# EAGLE design HW2 (EAGLE 9.3.0)
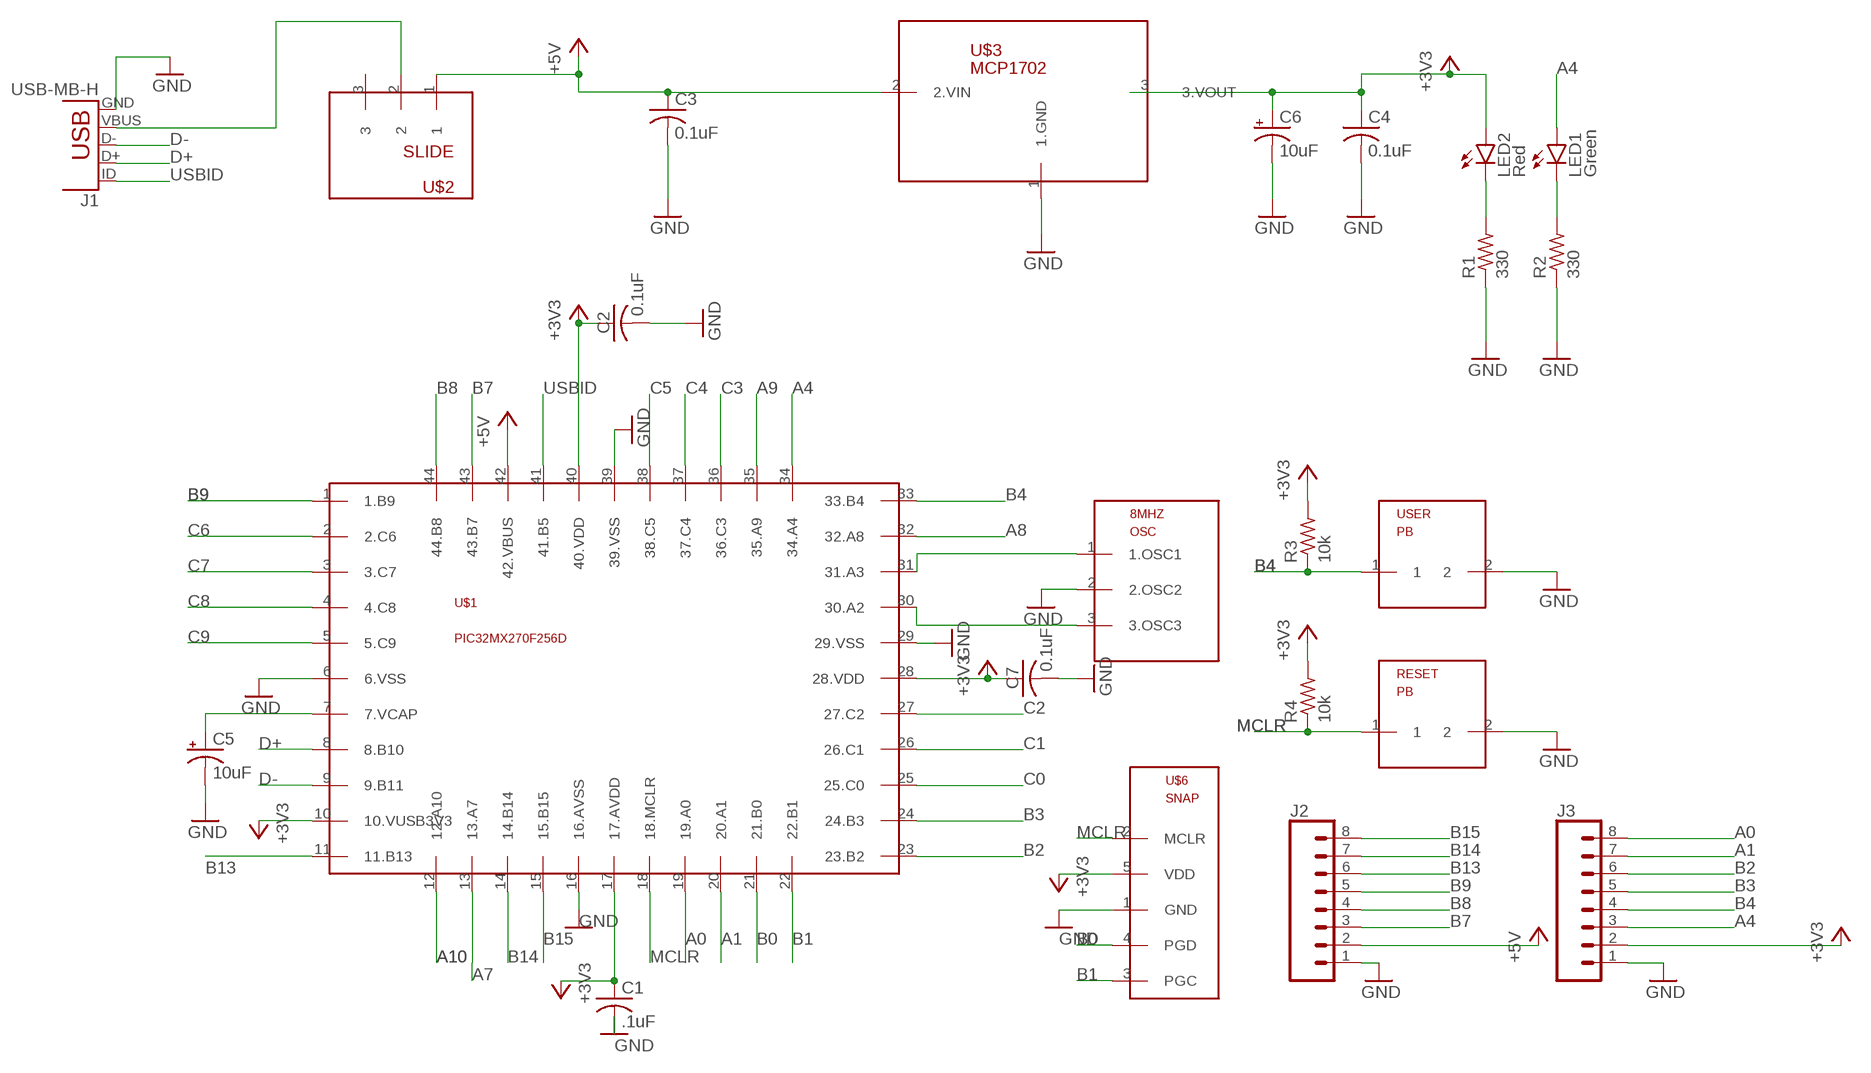
[diagram p0: schematic, sheet 1]

## Parts
8MHZ  OSC  [OSC]
C1  .1uF  C-US025-025X050  [C025-025X050]
C2  0.1uF  C-US025-025X050  [C025-025X050]
C3  0.1uF  C-US025-025X050  [C025-025X050]
C4  0.1uF  C-US025-025X050  [C025-025X050]
C5  10uF  CPOL-USB45181B  [B45181B]
C6  10uF  CPOL-USB45181B  [B45181B]
C7  0.1uF  C-US025-025X050  [C025-025X050]
J1  USB-MB-H  [USB-MB-H]
J2  CONN_08  [CONN_08]
J3  CONN_08  [CONN_08]
LED1  Green  LED3MM  [LED3MM]
LED2  Red  LED3MM  [LED3MM]
R1  330  R-US_0207/10  [0207/10]
R2  330  R-US_0207/10  [0207/10]
R3  10k  R-US_0207/10  [0207/10]
R4  10k  R-US_0207/10  [0207/10]
RESET  PB  [PB]
U$1  PIC32MX270F256D  [MQFP44-2]
U$2  SLIDE  [SLIDE]
U$3  MCP1702  [TO92]
U$6  SNAP  [1X05]
USER  PB  [PB]

## Nets
+3V3: C1.1 C2.1 C4.1 C6.+ C7.1 J3.2 LED2.A R3.2 R4.2 U$1.10(10.VUSB3V3) U$1.17(17.AVDD) U$1.28(28.VDD) U$1.40(40.VDD) U$3.3(3.VOUT) U$6.5(VDD)
+5V: C3.1 J2.2 U$1.42(42.VBUS) U$2.1 U$3.2(2.VIN)
A0: J3.8 U$1.19(19.A0)
A1: J3.7 U$1.20(20.A1)
A4: J3.3 LED1.A U$1.34(34.A4)
A7: U$1.13(13.A7)
A8: U$1.32(32.A8)
A9: U$1.35(35.A9)
A10: U$1.12(12.A10)
B0: U$1.21(21.B0) U$6.4(PGD)
B1: U$1.22(22.B1) U$6.3(PGC)
B2: J3.6 U$1.23(23.B2)
B3: J3.5 U$1.24(24.B3)
B4: J3.4 R3.1 U$1.33(33.B4) USER.1
B7: J2.3 U$1.43(43.B7)
B8: J2.4 U$1.44(44.B8)
B9: J2.5 U$1.1(1.B9)
B13: J2.6 U$1.11(11.B13)
B14: J2.7 U$1.14(14.B14)
B15: J2.8 U$1.15(15.B15)
C0: U$1.25(25.C0)
C1: U$1.26(26.C1)
C2: U$1.27(27.C2)
C3: U$1.36(36.C3)
C4: U$1.37(37.C4)
C5: U$1.38(38.C5)
C6: U$1.2(2.C6)
C7: U$1.3(3.C7)
C8: U$1.4(4.C8)
C9: U$1.5(5.C9)
D+: J1.D+ U$1.8(8.B10)
D-: J1.D- U$1.9(9.B11)
GND: 8MHZ.2(2.OSC2) C1.2 C2.2 C3.2 C4.2 C5.- C6.- C7.2 J1.GND J2.1 J3.1 R1.1 R2.1 RESET.2 U$1.6(6.VSS) U$1.16(16.AVSS) U$1.29(29.VSS) U$1.39(39.VSS) U$3.1(1.GND) U$6.1(GND) USER.2
MCLR: R4.1 RESET.1 U$1.18(18.MCLR) U$6.2(MCLR)
N$1: J1.VBUS U$2.2
N$2: LED2.K(C) R1.2
N$3: 8MHZ.1(1.OSC1) U$1.31(31.A3)
N$4: 8MHZ.3(3.OSC3) U$1.30(30.A2)
N$5: C5.+ U$1.7(7.VCAP)
N$6: LED1.K(C) R2.2
USBID: J1.ID U$1.41(41.B5)
Unconnected: U$2.3

## Library data of the parts
8MHZ = me_433_1:OSC
C1-C4 C7 = me_433_1:C-US: CAPACITOR, American symbol; SPICEPREFIX: C
C5 C6 = me_433_1:CPOL-US: POLARIZED CAPACITOR, American symbol; SPICEPREFIX: C
J1 = me_433_1:USB: USB Connectors USB-B-PTH is fully proven SKU : PRT-00139/CONN-08278 USB-miniB is fully proven SKU : PRT-00587 USB-A-PCB is untested. USB-A-H is throughly reviewed, but untested. Spark Fun Electronics SKU : PRT-00437 USB-B-SMT is throughly reviewed, but untested. Needs silkscreen touching up. USB-A-S has not been used/tested USB-MB-H has not been used/tested USB-MICROB has been used. CONN-09505
J2 J3 = me_433_1:CONN_08: Multi connection point. Often used as Generic Header-pin footprint for 0.1 inch spaced/style header connections On any of the 0.1 inch spaced packages, you can populate with these: Break Away Headers - Straight <https://www.sparkfun.com/products/116> (PRT-00116) Break Away Male Headers - Right Angle <https://www.sparkfun.com/products/553> (PRT-00553) Female Headers <https://www.sparkfun.com/products/115> (PRT-00115) Break Away Headers - Machine Pin <https://www.sparkfun.com/products/117> (PRT-00117) Break Away Female Headers - Swiss Machine Pin <https://www.sparkfun.com/products/743> (PRT-00743) Arduino Stackable Header - 8 Pin <https://www.sparkfun.com/products/9279> (PRT-09279) For SCREWTERMINALS and SPRING TERMINALS visit here: Screw Terimnals on SparkFun.com <https://www.sparkfun.com/search/results?term=Screw+Terminals> (5mm/3.5mm/2.54mm spacing) This device is also useful as a general connection point to wire up your design to another part of your project. Our various solder wires solder well into these plated through hole pads. Hook-Up Wire - Assortment (Stranded, 22 AWG) <https://www.sparkfun.com/products/11375> (PRT-11375) Hook-Up Wire - Assortment (Solid Core, 22 AWG) <https://www.sparkfun.com/products/11367> (PRT-11367) View the entire wire category on our website here <https://www.sparkfun.com/categories/141> Special notes: Molex polarized connector foot print use with SKU : PRT-08231 with associated crimp pins and housings. 1MM SMD Version SKU: PRT-10208 NOTES ON THE VARIANTS LOCK and LOCK_LONGPADS... This footprint was designed to help hold the alignment of a through-hole component (i.e. 6-pin header) while soldering it into place. You may notice that each hole has been shifted either up or down by 0.005 of an inch from it's more standard position (which is a perfectly straight line). This slight alteration caused the pins (the squares in the middle) to touch the edges of the holes. Because they are alternating, it causes a "brace" to hold the component in place. 0.005 has proven to be the perfect amount of "off-center" position when using our standard breakaway headers. Although looks a little odd when you look at the bare footprint, once you have a header in there, the alteration is very hard to notice. Also,if you push a header all the way into place, it is covered up entirely on the bottom side.
LED1 LED2 = led:LED: LED OSRAM: - CHIPLED LG R971, LG N971, LY N971, LG Q971, LY Q971, LO R971, LY R971 LH N974, LH R974 LS Q976, LO Q976, LY Q976 LO Q996 - Hyper CHIPLED LW Q18S LB Q993, LB Q99A, LB R99A - SideLED LS A670, LO A670, LY A670, LG A670, LP A670 LB A673, LV A673, LT A673, LW A673 LH A674 LY A675 LS A676, LA A676, LO A676, LY A676, LW A676 LS A679, LY A679, LG A679 - Hyper Micro SIDELED® LS Y876, LA Y876, LO Y876, LY Y876 LT Y87S - SmartLED LW L88C, LW L88S LB L89C, LB L89S, LG L890 LS L89K, LO L89K, LY L89K LS L896, LA L896, LO L896, LY L896 - TOPLED LS T670, LO T670, LY T670, LG T670, LP T670 LSG T670, LSP T670, LSY T670, LOP T670, LYG T670 LG T671, LOG T671, LSG T671 LB T673, LV T673, LT T673, LW T673 LH T674 LS T676, LA T676, LO T676, LY T676, LB T676, LH T676, LSB T676, LW T676 LB T67C, LV T67C, LT T67C, LS T67K, LO T67K, LY T67K, LW E67C LS E67B, LA E67B, LO E67B, LY E67B, LB E67C, LV E67C, LT E67C LW T67C LS T679, LY T679, LG T679 LS T770, LO T770, LY T770, LG T770, LP T770 LB T773, LV T773, LT T773, LW T773 LH T774 LS E675, LA E675, LY E675, LS T675 LS T776, LA T776, LO T776, LY T776, LB T776 LHGB T686 LT T68C, LB T68C - Hyper Mini TOPLED® LB M676 - Mini TOPLED Santana® LG M470 LS M47K, LO M47K, LY M47K Source: http://www.osram.convergy.de LUXEON: - LUMILED® LXK2-PW12-R00, LXK2-PW12-S00, LXK2-PW14-U00, LXK2-PW14-V00 LXK2-PM12-R00, LXK2-PM12-S00, LXK2-PM14-U00 LXK2-PE12-Q00, LXK2-PE12-R00, LXK2-PE12-S00, LXK2-PE14-T00, LXK2-PE14-U00 LXK2-PB12-K00, LXK2-PB12-L00, LXK2-PB12-M00, LXK2-PB14-N00, LXK2-PB14-P00, LXK2-PB14-Q00 LXK2-PR12-L00, LXK2-PR12-M00, LXK2-PR14-Q00, LXK2-PR14-R00 LXK2-PD12-Q00, LXK2-PD12-R00, LXK2-PD12-S00 LXK2-PH12-R00, LXK2-PH12-S00 LXK2-PL12-P00, LXK2-PL12-Q00, LXK2-PL12-R00 Source: www.luxeon.com KINGBRIGHT: KA-3528ASYC Source: www.kingbright.com
R1-R4 = me_433_1:R-US_: RESISTOR, American symbol; SPICEPREFIX: R
RESET USER = me_433_1:PB
U$1 = me_433_1:PIC32MX270F256D
U$2 = me_433_1:SLIDE
U$3 = me_433_1:MCP1702
U$6 = me_433_1:SNAP

## Board
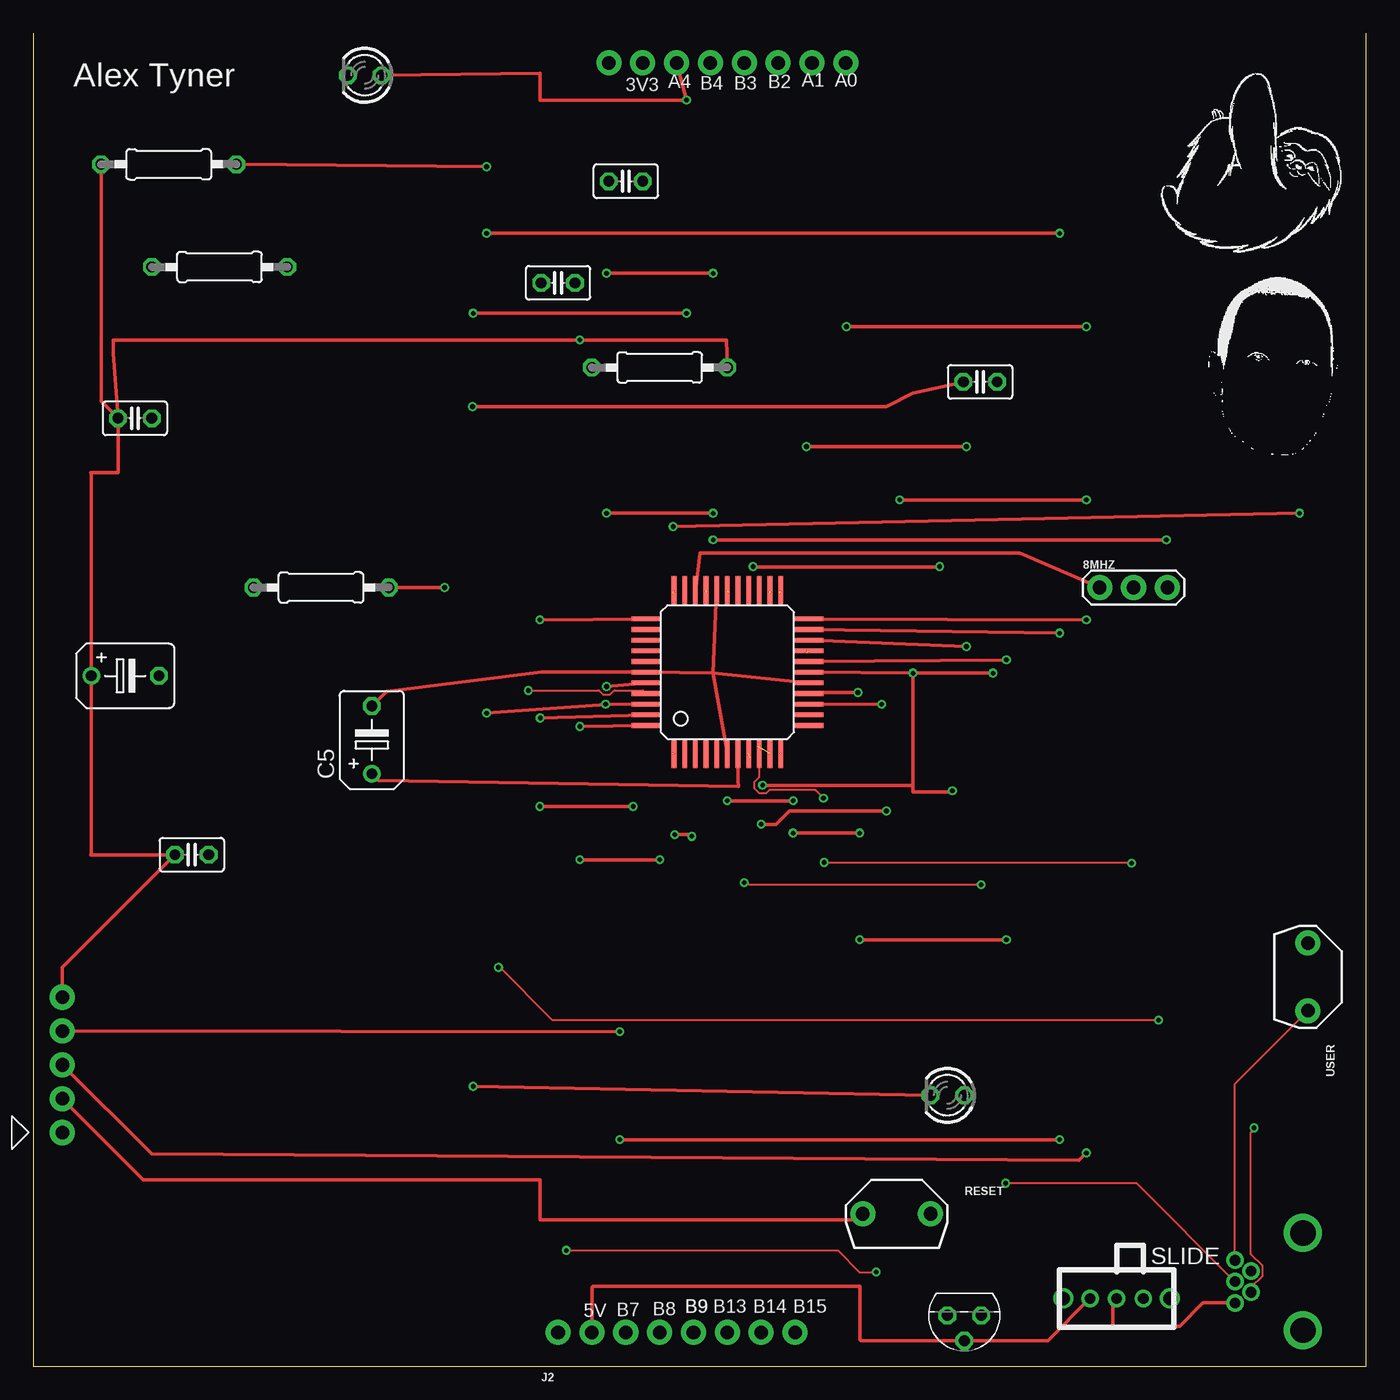
[diagram p1: board, top side]
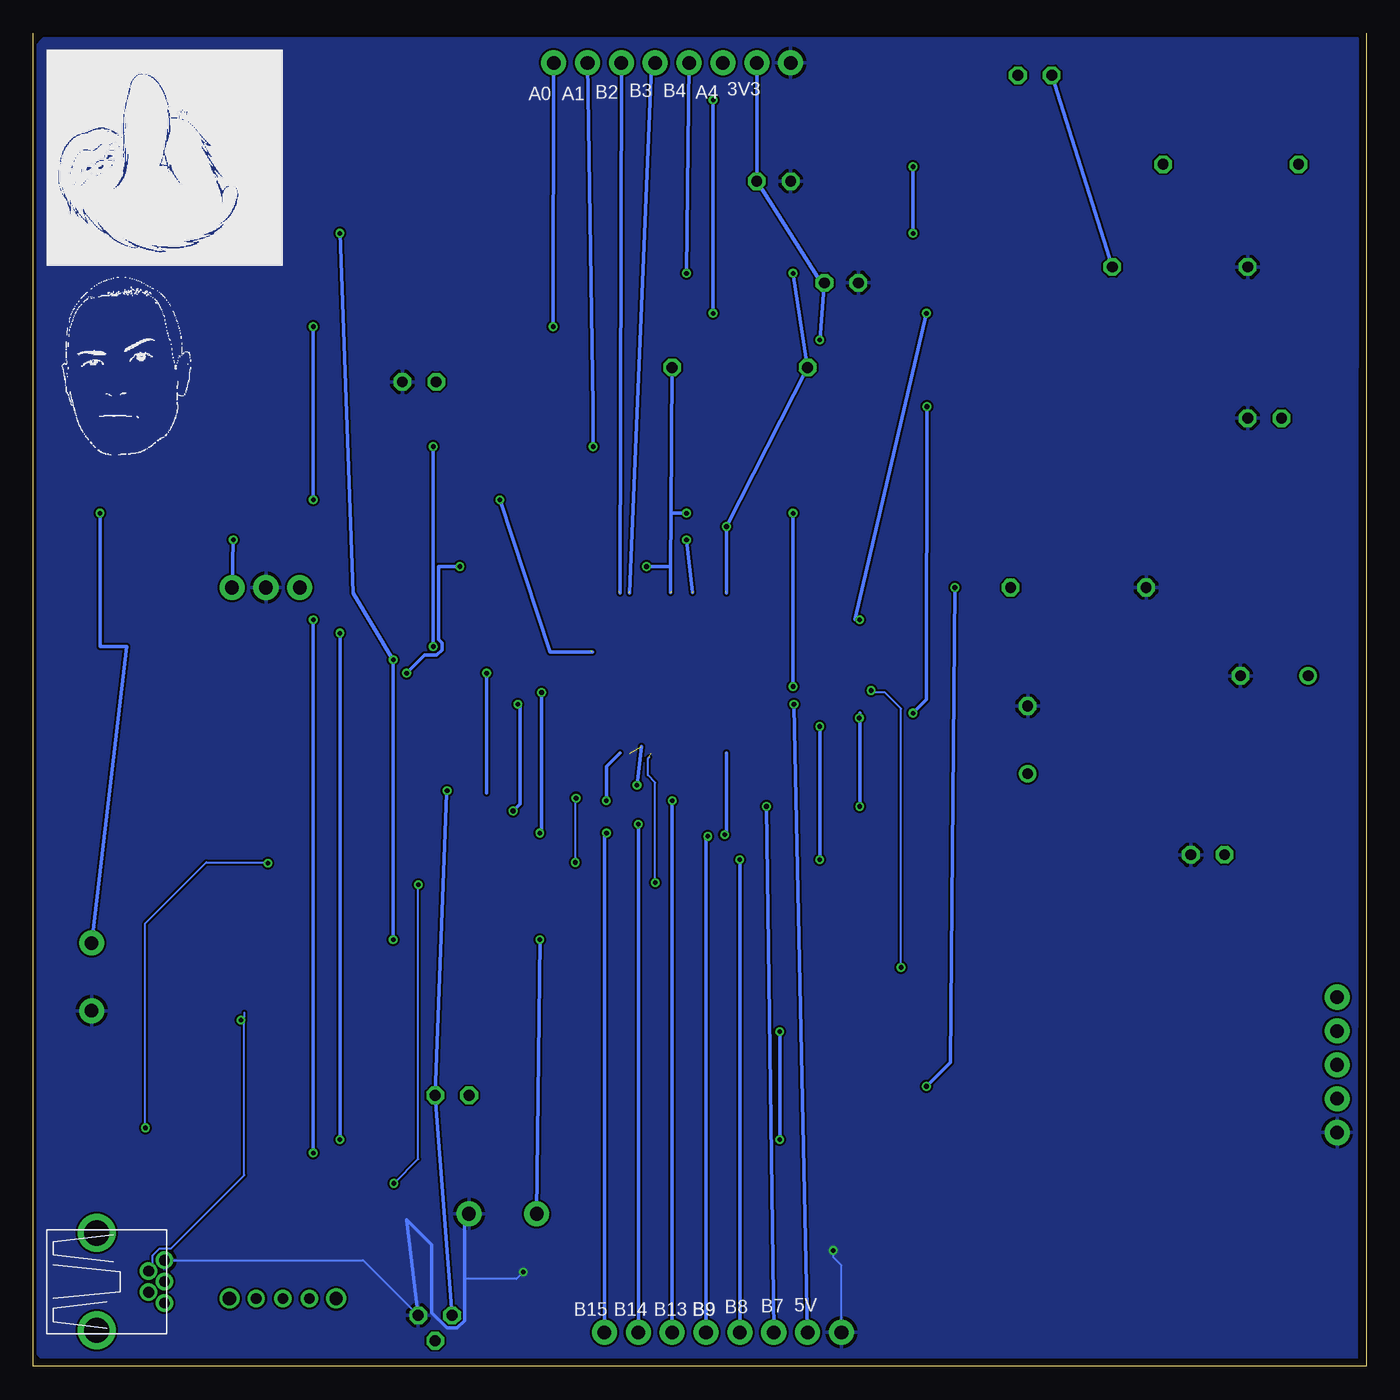
[diagram p2: board, bottom side, seen from below]

Size 100 x 100 mm. Coordinates in mm from the lower left corner, seen from the top.
Outline: 100,100 100,0 0,0 0,100
Copper layers (1*16): Top 0.035mm / dielectric 1.5mm / Bottom 0.035mm
Design rules "SeeedStudio_2layer_DRU_no_angle_20140221": minimum track width 6mil, minimum drill 12mil, track to track 6mil, track to pad 6mil, pad to pad 6mil, via to via 6mil, smd to smd 0mil, copper to edge 10mil, drill to drill 10mil, minimum pad ring 10mil, minimum via ring 6mil, stop-mask expansion 2mil, vias tented up to drill 100mil, thermal gap 10mil

### Footprints (pad centres in the part's own frame; a part is rotated, then mirrored left to right if it is on the bottom)
OSC = drill 1.016 pad 1.88: 1 -2.54,0; 2 0,0; 3 2.54,0
C025-025X050 = drill 0.813 octagon: 1 -1.27,0; 2 1.27,0
B45181B = drill 0.813: + -2.54,0 | drill 0.813 octagon: - 2.54,0
USB-MB-H = drill 0.8: D+ 5.1,0; D- 3.9,0.8; GND 5.1,-1.6; ID 3.9,-0.8; VBUS 5.1,1.6 | drill 1.9: P$6 0,-3.65; P$7 0,3.65
CONN_08 = drill 1.016 pad 1.88: 1 -8.89,0; 2 -6.35,0; 3 -3.81,0; 4 -1.27,0; 5 1.27,0; 6 3.81,0; 7 6.35,0; 8 8.89,0
LED3MM = drill 0.813 octagon: A -1.27,0; K 1.27,0
0207/10 = drill 0.813 octagon: 1 -5.08,0; 2 5.08,0
PB = drill 1.016 pad 1.88: 1 -2.54,0; 2 2.54,0
MQFP44-2 = smd 0.35 x 2.2: 1 -4,-6.1; 2 -3.2,-6.1; 3 -2.4,-6.1; 4 -1.6,-6.1; 5 -0.8,-6.1; 6 0,-6.1; 7 0.8,-6.1; 8 1.6,-6.1; 9 2.4,-6.1; 10 3.2,-6.1; 11 4,-6.1; 23 4,6.1; 24 3.2,6.1; 25 2.4,6.1; 26 1.6,6.1; 27 0.8,6.1; 28 0,6.1; 29 -0.8,6.1; 30 -1.6,6.1; 31 -2.4,6.1; 32 -3.2,6.1; 33 -4,6.1 | smd 2.2 x 0.35: 12 6.1,-4; 13 6.1,-3.2; 14 6.1,-2.4; 15 6.1,-1.6; 16 6.1,-0.8; 17 6.1,0; 18 6.1,0.8; 19 6.1,1.6; 20 6.1,2.4; 21 6.1,3.2; 22 6.1,4; 34 -6.1,4; 35 -6.1,3.2; 36 -6.1,2.4; 37 -6.1,1.6; 38 -6.1,0.8; 39 -6.1,0; 40 -6.1,-0.8; 41 -6.1,-1.6; 42 -6.1,-2.4; 43 -6.1,-3.2; 44 -6.1,-4
SLIDE = drill 0.8: 1 -2,0; 2 0,0; 3 2,0 | drill 1: P$1 -4,0; P$2 4,0
TO92 = drill 0.813 octagon: 1 -1.27,0; 2 0,1.905; 3 1.27,0
1X05 = drill 1.016 pad 1.88: 1 0,0; 2 2.54,0; 3 5.08,0; 4 7.62,0; 5 10.16,0

### Placement (x,y rotation side)
8MHZ  82.55,58.42 0 top
C1  7.62,71.12 0 top
C2  11.89,38.37 0 top
C3  71.04,73.85 0 top
C4  44.45,88.9 180 top
C5  25.4,46.99 90 top
C6  6.89,51.8 0 top
C7  39.37,81.28 180 top
J1  95.25,6.35 180 top
J2  48.26,2.54 0 top
J3  52.07,97.79 0 top
LED1  24.86,96.85 180 top
LED2  68.58,20.32 180 top
R1  21.59,58.42 0 top
R2  13.97,82.47 0 top
R3  46.99,74.93 0 top
R4  10.16,90.17 180 top
RESET  64.77,11.43 0 top
U$1  52.07,52.07 0 top
U$2  81.28,5.08 0 top
U$3  69.85,3.81 180 top
U$6  2.18,17.53 90 top
USER  95.63,29.21 270 top

### Tracks (layer width: path | path; a pad name or v marks a point on that pad's centre or on a via)
+3V3  (via drill 0.35)  (2 unrouted)
  Top 0.254: C1.1 6.35,67.06 4.32,67.06 4.35,67.02 C6.+ 4.35,38.39 4.32,38.35 10.6,38.35 | 10.6,38.35 C2.1 | 10.6,38.35 2.18,29.93 U$6.5 | R4.2 5.08,72.39 C1.1 | C1.1 6,76 6,77 v41,77 52,77 R3.2 | v68.96,43.18 68.86,43.08 66,43.08 66,43.58 | 66,43.58 v54.71,43.58 | U$1.17 v66,52 | v66,52 66,43.58 | U$1.40 v43,51 | v43,64 v51,64 | v68,60 67.95,59.95 54.2,59.95 54.15,60 v54,60 | v66,52 v72,52
  Bottom 0.254: U$3.3 LED2.A 69,43 v68.96,43.18 | v41,77 40.67,80.97 | 40.67,80.97 C7.1 | J3.2 C4.1 40.67,80.97 | 54.37,46.51 v54.71,43.58 | R3.2 52.15,64 | 52.15,64 52.18,60 | 52.18,60 | 52.18,60 v54,60 | 52.18,60 52.2,58.04 | v66,52 66,43 | v43,51 v43,64 | v72,52 70.66,53.34 69.73,53.34 69.34,53.73 69.34,54.27 69.59,54.52 69.59,60 v68,60 | v51,64 52.15,64
+5V  (via drill 0.35)
  Top 0.254: U$2.1 76.11,1.91 U$3.2 62.09,1.91 62,2 62,6 42,6 41.91,5.91 J2.2 | v42.93,49.66 43,49.66 | 43,49.66 U$1.42 | C3.1 66,73 64,72 36,72 35.99,72 v32.96,71.99 | v34,49 43,49.66
  Bottom 0.254: J2.2 42.93,49.53 v42.93,49.66 | v34,49 33,50 v32.96,71.99
A0  (via drill 0.35)  (1 unrouted)
  Top 0.254: v61,78 v79,78 | v79,65 v65,65
  Bottom 0.254: J3.8 v61,78 | v79,78 v79,65 | v65,65 61.21,53.59 58.04,53.59
A1  (via drill 0.35)
  Top 0.254: v58,69 v70,69 | v70,54 U$1.20
  Bottom 0.254: J3.7 58,72 v58,69 | v70,69 v70,54
A4  (via drill 0.35)
  Top 0.254: LED1.A 38,97 38,95 v49,95 J3.3 | v49,79 v33,79 | v38,56 U$1.34
  Bottom 0.254: v49,95 v49,79 | v33,79 38.35,56.01 v38,56
B0  (via drill 0.35)
  Top 0.254: U$6.4 v44,25.1 | v44,17 v77,17 | v77,55 U$1.21
  Bottom 0.254: v44,25.1 v44,17 | v77,17 v77,55
B1  (via drill 0.35)
  Top 0.254: v79,16 78.45,15.45 8.87,15.92 U$6.3 | v79,56 U$1.22
  Bottom 0.254: v79,16 v79,56
B2  (1 unrouted)
  Bottom 0.254: J3.6 56,58
B3  (1 unrouted)
  Bottom 0.254: 55.25,58 53.6,97.53 J3.5
B4  (via drill 0.35)  (1 unrouted)
  Top 0.254: v95,64 v48,63 | v51,82 v43,82
  Bottom 0.254: USER.1 93,54 95,54 v95,64 | 48,58 v48,63 R3.1 v43,82 | J3.4 v51,82
B7  (via drill 0.35)
  Top 0.254: v45,42 v38,42 | v38.03,48.63 U$1.43
  Bottom 0.254: J2.3 v45,42 | v38,42 38,49 v38.03,48.63
B8  (via drill 0.35)
  Top 0.254: v47,38 v41,38 | v41,48 U$1.44
  Bottom 0.254: J2.4 v47,38 | v41,38 v41,48
B9  (via drill 0.35)  (1 unrouted)
  Top 0.254: v49.4,39.75 49.28,39.88 v48.13,39.88
  Bottom 0.254: J2.5 49.53,39.75 v49.4,39.75 | v48.13,39.88 48,40.01 48,46
B13  (via drill 0.35)  (1 unrouted)
  Top 0.254: v52.07,42.42 v57.01,42.42 57.13,42.42
  Bottom 0.254: J2.6 v52.07,42.42 | v57.01,42.42 57.01,44.99 56,46
B14  (via drill 0.35)
  Top 0.254: v54.61,40.66 55.73,40.66 56.73,41.66 63.27,41.66 v64.01,41.66 | v63.66,49.66 U$1.14
  Bottom 0.254: J2.7 v54.61,40.66 | v64.01,41.66 63.5,42.16 63.5,49.66 v63.66,49.66
B15  (via drill 0.35)
  Top 0.254: v62,40 v57,40 | v61.87,50.55 58.25,50.55 U$1.15
  Bottom 0.254: J2.8 57.15,39.85 v57,40 | v61.87,50.55 61.87,40.13 v62,40
D+  (via drill 0.35)  (1 unrouted)
  Top 0.152: J1.D+ 82.78,13.72 v72.95,13.72 | v71.12,36.12 53.75,36.12 53.54,36.32 53.49,36.27 v53.34,36.27
  Bottom 0.152: v72.95,13.72 71.12,15.54 v71.12,36.12 | v53.34,36.27 53.34,43.79 53.9,44.35 53.9,45.57 53.8,45.67
D-  (via drill 0.35)
  Top 0.152: J1.D- 91.35,5.9 92.23,6.78 92.23,7.52 91.35,8.4 91.35,17.54 91.59,17.78 v91.59,17.88 | v82.4,37.74 59.44,37.74 59.38,37.8 v59.33,37.8 | v59.28,42.62 58.68,43.23 55.22,43.23 54.97,42.98 54.46,42.98 54.11,43.33 54.11,43.84 54.47,44.2 U$1.9
  Bottom 0.152: v91.59,17.88 91.59,33.22 87.02,37.8 82.45,37.8 v82.4,37.74 | v59.33,37.8 59.33,42.37 59.08,42.62 v59.28,42.62
GND  (via drill 0.35)
  Top 0.152: J1.GND 90.15,21.19 USER.2 | v39.98,8.69 60.35,8.69 61.98,7.06 v63.25,7.06
  Top 0.254: C5.- 26.51,50.64 38.12,52.07 U$1.39 51,52 | U$1.29 51,52 | U$1.6 51,52 | U$1.16 51,52
  Bottom 0.152: J1.GND 75.26,7.95 U$3.1 | J2.1 39.37,7.57 39.98,8.18 v39.98,8.69 | v63.25,7.06 63.75,6.55 67.64,6.55
  Bottom 0.254: RESET.2 67.64,11.1 67.64,6.55 67.64,3.42 68.19,2.87 68.97,2.87 70.12,4.02 70.12,9.12 72,11 U$3.1
  pour Bottom (isolate 0): 0.61,99.62 99.26,99.62 99.87,99.01 99.87,1.07 99.47,0.66 0.66,0.66
MCLR  (via drill 0.35)
  Top 0.254: U$6.2 8.25,14 38,14 38,11 61.8,11 RESET.1 | v62,32 v73,32 | v73,53 U$1.18 | R4.1 v34,90 | v34,85 v77,85
  Bottom 0.254: RESET.1 v62,32 | v73,32 v73,53 76,58 v77,85 | v34,90 v34,85
N$1
  Top 0.254: J1.VBUS 87.75,4.75 86,3 81,3 81,4.8 U$2.2
N$2  (via drill 0.35)
  Top 0.254: v30.86,58.42 R1.2 | v33,21 LED2.K
  Bottom 0.254: v33,21 31.21,22.79 v30.86,58.42
N$3
  Top 0.254: 8MHZ.1 74,61 50,61 U$1.31
N$4  (via drill 0.35)  (1 unrouted)
  Top 0.254: v85,62 v51,62
  Bottom 0.254: 8MHZ.3 v85,62 | v51,62 50.55,58.04
N$5
  Top 0.254: C5.+ 25.92,43.93 52.9,43.49 52.87,43.94 U$1.7
N$6
  Bottom 0.254: R2.2 LED1.K
USBID  (via drill 0.35)
  Top 0.152: v84.43,25.96 38.96,25.96 34.9,30.02 v34.9,29.92 | U$1.41 45.74,50.7 43.61,50.7 43.55,50.69 43.25,50.39 42.75,50.39 42.44,50.7 v37.13,50.7
  Bottom 0.152: 84.18,26.21 84.18,14.32 89.67,8.83 90.52,8.83 91.03,8.32 91.03,7.47 J1.ID | 84.18,26.52 84.18,26.21 | 84.18,26.21 v84.43,25.96 | v34.9,29.92 34.9,49.33 36.12,50.55 36.98,50.55 v37.13,50.7

### Text on the board
tPlace: Alex Tyner | 3V3 | A4 | B4 | B3 | B2 | A1 | A0 | 5V | B7 | B8 | B9 | B9 | B13 | B14 | B15
bPlace: 3V3 | A4 | B4 | B3 | B2 | A1 | A0 | 5V | B7 | B8 | B9 | B9 | B13 | B14 | B15